# Altium schematic sheet MAZ000170 - Diagrama físico.SchDoc: MAZ000170 - Diagrama físico
size A; ApprovedBy: Christian Ledwidth; CheckedBy: Nahuel Martinez; Author: Santiago Marti; CompanyName: Body Health; DrawnBy: Santiago Marti; Revision: A; SheetNumber: 2; SheetTotal: 2
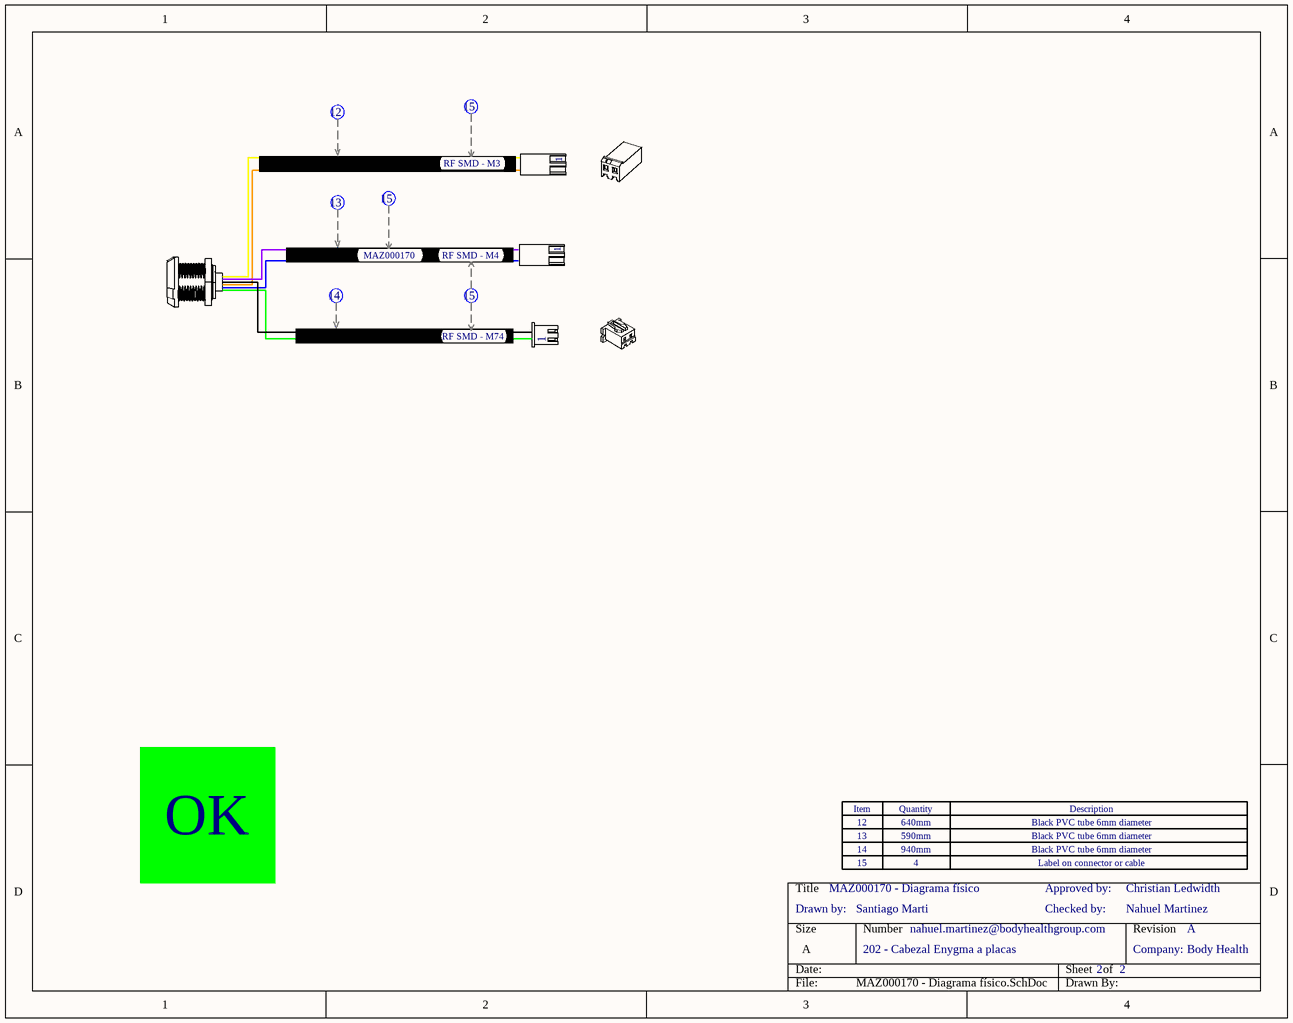
[diagram p0: MAZ000170 - Diagrama físico.SchDoc]

## Parts
(Parts that share a designator on the sheet are numbered #1, #2 ... from top to bottom, then left to right.)
Cab1  Cable  (value not drawn)
Cab2  Cable  (value not drawn)
Cab3  Cable  (value not drawn)
Cab4  Cable  (value not drawn)
Cab?#1  Cable  (value not drawn)
Cab?#2  Cable  (value not drawn)
Con1  SL156-2  (value not drawn)  (parts A,B of 4)
Con2  SL156-2  (value not drawn)  (part A of 4)
Con3  XHP-2  (value not drawn)  (parts A,B of 4)
Conn1  SZCNT_07_Hembra  (value not drawn)  (part A of 3)
Zoc?#1  Zócalo_Header  (value not drawn)
Zoc?#2  Zócalo_Item  (value not drawn)
Zoc?#3  Zócalo_Item  (value not drawn)
Zoc?#4  Zócalo_Item  (value not drawn)
Zoc?#5  Zócalo_Item  (value not drawn)

## Notes on the sheet
- RF SMD - M3
- MAZ000170
- RF SMD - M4
- RF SMD - M74
- OK
- (near Zoc?#1) 12
- (near Zoc?#2) 13
- 640mm
- 590mm
- Black PVC tube 6mm diameter
- (near Zoc?#5) Drawn by:
- (near Zoc?#3) 14
- (near Zoc?#4) 15
- 940mm
- 4
- Checked by:
- Approved by:
- Label on connector or cable
- 202 - Cabezal Enygma a placas
- nahuel.martinez@bodyhealthgroup.com
- Company:
- (in symbol Zócalo_Header) Item; Quantity; Description

## Library data of the parts
Cab1 Cab4 Cab?#2 = Cable: CallOut: 15; Largo: *mm; Sección: *mm2; Color: *
Cab2 = Cable: CallOut: 13; Largo: *mm; Sección: *mm2; Color: *
Cab3 = Cable: CallOut: 14; Largo: *mm; Sección: *mm2; Color: *
Cab?#1 = Cable: CallOut: 12; Largo: *mm; Sección: *mm2; Color: *
Con1 Con2 = SL156-2: CONN RECEPT 2 POS W/RAMP SL-156; Cod.Fabricante: 640250-2; Fabricante: TE Connectivity AMP Connectors; Cod.DigiKey: A19950-ND; ComponentLink1Description: Manufacturer Link; ComponentLink1URL: https://www.te.com/commerce/DocumentDelivery/DDEController?Action=srchrtrv&DocNm=640250&DocType=Customer+Drawing&DocLang=English; DIGIKEYx50: 0.11420; CallOut: *; DIGIKEYx100: NO
Con3 = XHP-2: CONN HOUSING 2.5MM 2POS; Fabricante: JST Sales America Inc.; Cod.DigiKey: 455-2266-ND; Cod.Fabricante: XHP-2; ComponentLink1Description: Manufacturer Link; ComponentLink1URL: http://www.jst-mfg.com/product/pdf/eng/eXH.pdf; DIGIKEYx50: 0.05620; CallOut: *; DIGIKEYx100: NO
Conn1 = SZCNT_07_Hembra: Conector SZCNT 7 vías hembra para gabinete; Cod.DigiKey: Se compra a SZCNT; Cod.Fabricante: *; ComponentLink1Description: Manufacturer Link; ComponentLink1URL: *; DIGIKEYx100: *; Fabricante: SZCNT; CallOut: *; DIGIKEYx50: *
Zoc?#1 = Zócalo_Header: Header para el zócalo de referencias
Zoc?#2-Zoc?#5 = Zócalo_Item: Ítem para el zócalo de referencias; Desginator: *; Quantity: *; ItemDescription: *